# Altium project Arduino_CH32X033F8P6.PrjPcb
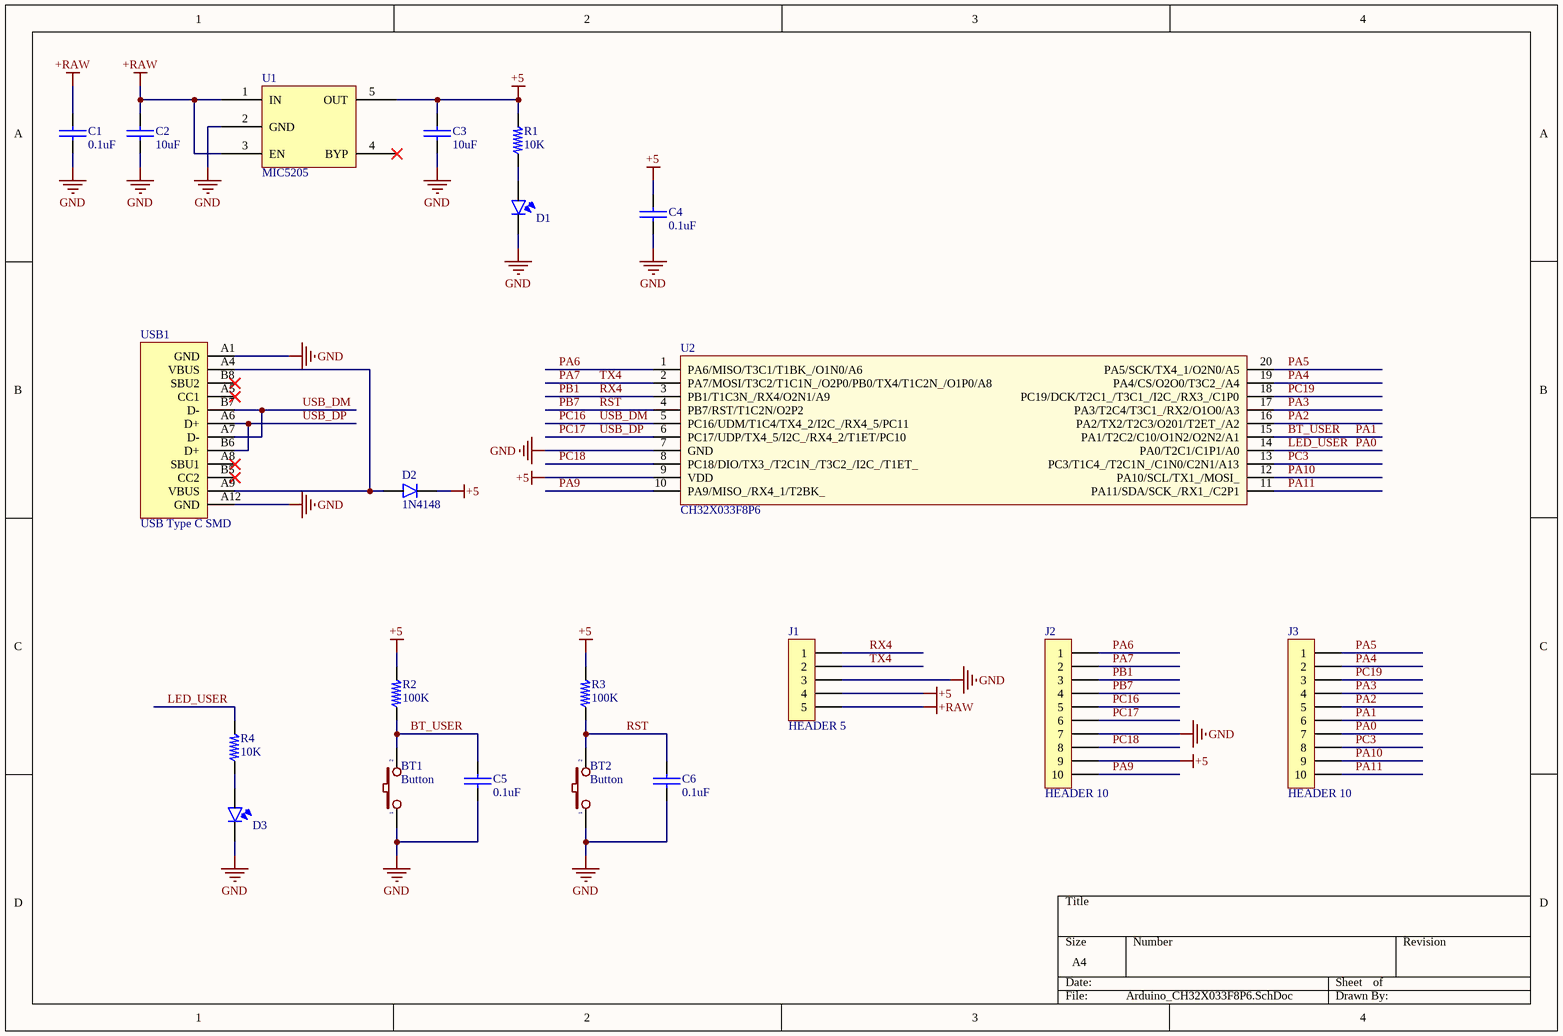
[diagram p0: Arduino_CH32X033F8P6.SchDoc]
1 sheet, 21 parts. Net scope: global (net labels, ports and power ports of the same name join across sheets).
Board file: Arduino_CH32X033F8P6.PcbDoc

## Sheet Arduino_CH32X033F8P6.SchDoc
size A4; SheetNumber: 1; SheetTotal: 1

### Parts
BT1  Button  [Switch 3x4x2mm]
BT2  Button  [Switch 3x4x2mm]
C1  0.1uF  [CAP 0603]
C2  10uF  [CAP 0603]
C3  10uF  [CAP 0603]
C4  0.1uF  [CAP 0603]
C5  0.1uF  [CAP 0603]
C6  0.1uF  [CAP 0603]
D1  LED  [LED 0603]  (value not drawn)
D2  1N4148  [SOD-323]
D3  LED  [LED 0603]  (value not drawn)
J1  HEADER 5  [HEADER 5]
J2  HEADER 10  [HEADER 10]
J3  HEADER 10  [HEADER 10]
R1  10K  [RES 0603]
R2  100K  [RES 0603]
R3  100K  [RES 0603]
R4  10K  [RES 0603]
U1  MIC5205  [SOT23-5]
U2  CH32X033F8P6  [TSSOP20_STM]
USB1  USB Type C SMD  [USB TYPE C]

### Nets
+5: C3.1 C4.1 D2.2 J1.4 J2.9 R1.2 R2.2 R3.2 U1.5(OUT) U2.9(VDD)
+RAW: C1.1 C2.1 J1.5 U1.1(IN) U1.3(EN)
GND: BT1.1 BT2.1 C1.2 C2.2 C3.2 C4.2 C5.2 C6.2 D1.2 D3.2 J1.3 J2.7 U1.2(GND) U2.7(GND) USB1.A1(GND) USB1.A12(GND)
BT_USER: BT1.2 C5.1 J3.6 R2.1 U2.15(PA1/T2C2/C10/O1N2/O2N2/A1)  [also labelled PA1]
LED_USER: J3.7 R4.2 U2.14(PA0/T2C1/C1P1/A0)  [also labelled PA0]
PA2: J3.5 U2.16(PA2/TX2/T2C3/O201/T2ET_/A2)
PA3: J3.4 U2.17(PA3/T2C4/T3C1_/RX2/O1O0/A3)
PA4: J3.2 U2.19(PA4/CS/O2O0/T3C2_/A4)
PA5: J3.1 U2.20(PA5/SCK/TX4_1/O2N0/A5)
PA6: J2.1 U2.1(PA6/MISO/T3C1/T1BK_/O1N0/A6)
PA7: J1.2 J2.2 U2.2(PA7/MOSI/T3C2/T1C1N_/O2P0/PB0/TX4/T1C2N_/O1P0/A8)  [also labelled TX4]
PA9: J2.10 U2.10(PA9/MISO_/RX4_1/T2BK_)
PA10: J3.9 U2.12(PA10/SCL/TX1_/MOSI_)
PA11: J3.10 U2.11(PA11/SDA/SCK_/RX1_/C2P1)
PB1: J1.1 J2.3 U2.3(PB1/T1C3N_/RX4/O2N1/A9)  [also labelled RX4]
PB7: BT2.2 C6.1 J2.4 R3.1 U2.4(PB7/RST/T1C2N/O2P2)  [also labelled RST]
PC3: J3.8 U2.13(PC3/T1C4_/T2C1N_/C1N0/C2N1/A13)
PC16: J2.5 U2.5(PC16/UDM/T1C4/TX4_2/I2C_/RX4_5/PC11) USB1.A7(D-) USB1.B7(D-)  [also labelled USB_DM]
PC17: J2.6 U2.6(PC17/UDP/TX4_5/I2C_/RX4_2/T1ET/PC10) USB1.A6(D+) USB1.B6(D+)  [also labelled USB_DP]
PC18: J2.8 U2.8(PC18/DIO/TX3_/T2C1N_/T3C2_/I2C_/T1ET_)
PC19: J3.3 U2.18(PC19/DCK/T2C1_/T3C1_/I2C_/RX3_/C1P0)
NetD1_1: D1.1 R1.1
NetD2_1: D2.1 USB1.A4(VBUS) USB1.A9(VBUS)
NetD3_1: D3.1 R4.1

Not connected (* = marked no-connect by the designer): U1 4(BYP)*; USB1 A5(CC1)* A8(SBU1)* B5(CC2)* B8(SBU2)*

### Library data of the parts
BT1 BT2 = Button 2 Pin: Value: SW chip 2 pin
C1-C6 = Capacitor SMD
D2 = Diode
R1-R4 = Resistor SMD
U1 = MIC5205: 150mA Low-Noise LDO Regulator
U2 = CH32X035/X033
USB1 = USB Type C 16